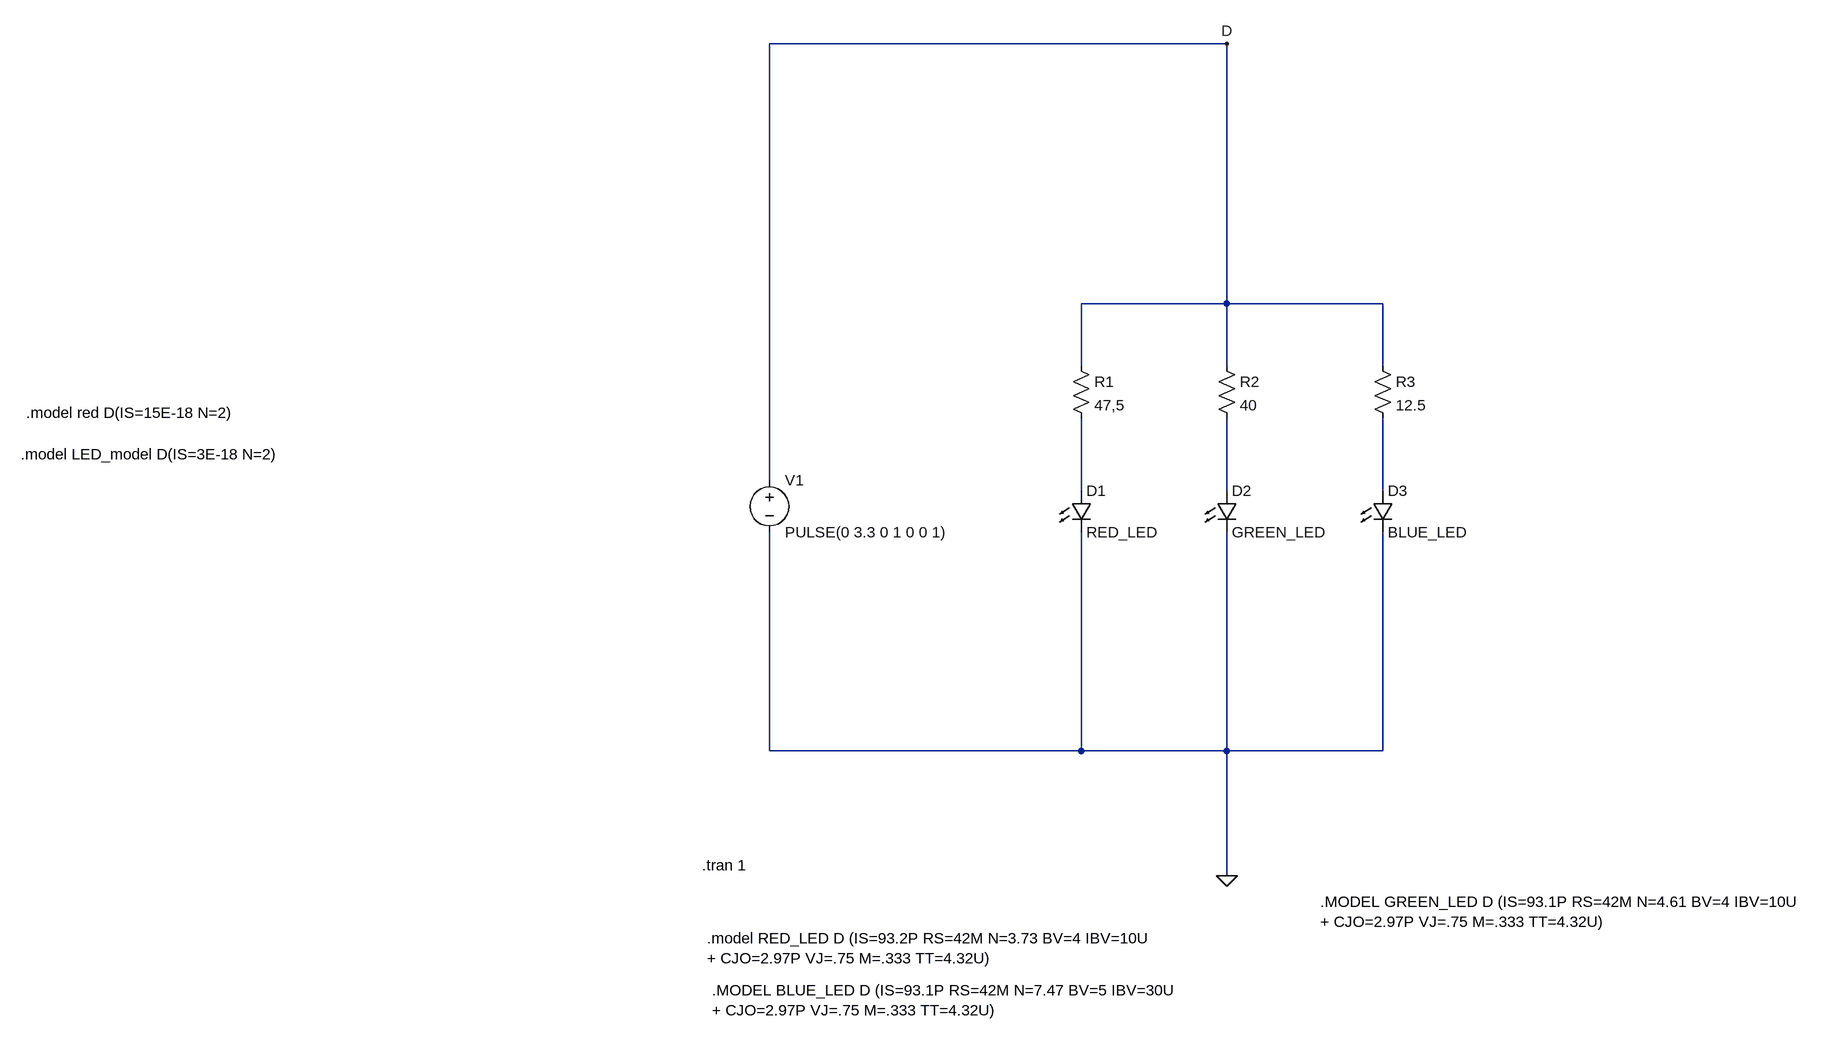
[diagram p0: schematic LED_Circuit.asc]
LED_Circuit.asc, the LTspice schematic file:
Version 4
SHEET 1 2152 956
WIRE 688 -544 -16 -544
WIRE 688 -144 688 -544
WIRE 688 -144 464 -144
WIRE 928 -144 688 -144
WIRE 464 -48 464 -144
WIRE 688 -48 688 -144
WIRE 928 -48 928 -144
WIRE -16 128 -16 -544
WIRE 464 144 464 32
WIRE 688 144 688 32
WIRE 928 144 928 32
WIRE -16 544 -16 208
WIRE 464 544 464 208
WIRE 464 544 -16 544
WIRE 688 544 688 208
WIRE 688 544 464 544
WIRE 928 544 928 208
WIRE 928 544 688 544
WIRE 688 736 688 544
FLAG 688 736 0
FLAG 688 -544 D
SYMBOL voltage -16 112 R0
WINDOW 123 0 0 Left 0
WINDOW 39 0 0 Left 0
SYMATTR InstName V1
SYMATTR Value PULSE(0 3.3 0 1 0 0 1)
SYMBOL LED 448 144 R0
SYMATTR InstName D1
SYMATTR Value RED_LED
SYMBOL LED 672 144 R0
SYMATTR InstName D2
SYMATTR Value GREEN_LED
SYMBOL LED 912 144 R0
SYMATTR InstName D3
SYMATTR Value BLUE_LED
SYMBOL res 448 -64 R0
SYMATTR InstName R1
SYMATTR Value 47,5
SYMBOL res 672 -64 R0
SYMATTR InstName R2
SYMATTR Value 40
SYMBOL res 912 -64 R0
SYMATTR InstName R3
SYMATTR Value 12.5
TEXT -1168 88 Left 2 !.model LED_model D(IS=3E-18 N=2)
TEXT -120 720 Left 2 !.tran 1
TEXT -1160 24 Left 2 !.model red D(IS=15E-18 N=2)
TEXT -112 832 Left 2 !.model RED_LED D (IS=93.2P RS=42M N=3.73 BV=4 IBV=10U\n+ CJO=2.97P VJ=.75 M=.333 TT=4.32U)
TEXT -104 912 Left 2 !.MODEL BLUE_LED D (IS=93.1P RS=42M N=7.47 BV=5 IBV=30U\n+ CJO=2.97P VJ=.75 M=.333 TT=4.32U)
TEXT 832 776 Left 2 !.MODEL GREEN_LED D (IS=93.1P RS=42M N=4.61 BV=4 IBV=10U\n+ CJO=2.97P VJ=.75 M=.333 TT=4.32U)

The netlist it stands for:
* LED_Circuit.asc
V1 D 0 PULSE(0 3.3 0 1 0 0 1)
D1 N001 0 RED_LED
D2 N002 0 GREEN_LED
D3 N003 0 BLUE_LED
R1 D N001 47,5
R2 D N002 40
R3 D N003 12.5
.model D D
.lib standard.dio
.model LED_model D(IS=3E-18 N=2)
.tran 1
.model red D(IS=15E-18 N=2)
.model RED_LED D (IS=93.2P RS=42M N=3.73 BV=4 IBV=10U
+ CJO=2.97P VJ=.75 M=.333 TT=4.32U)
.MODEL BLUE_LED D (IS=93.1P RS=42M N=7.47 BV=5 IBV=30U
+ CJO=2.97P VJ=.75 M=.333 TT=4.32U)
.MODEL GREEN_LED D (IS=93.1P RS=42M N=4.61 BV=4 IBV=10U
+ CJO=2.97P VJ=.75 M=.333 TT=4.32U)
.backanno
.end